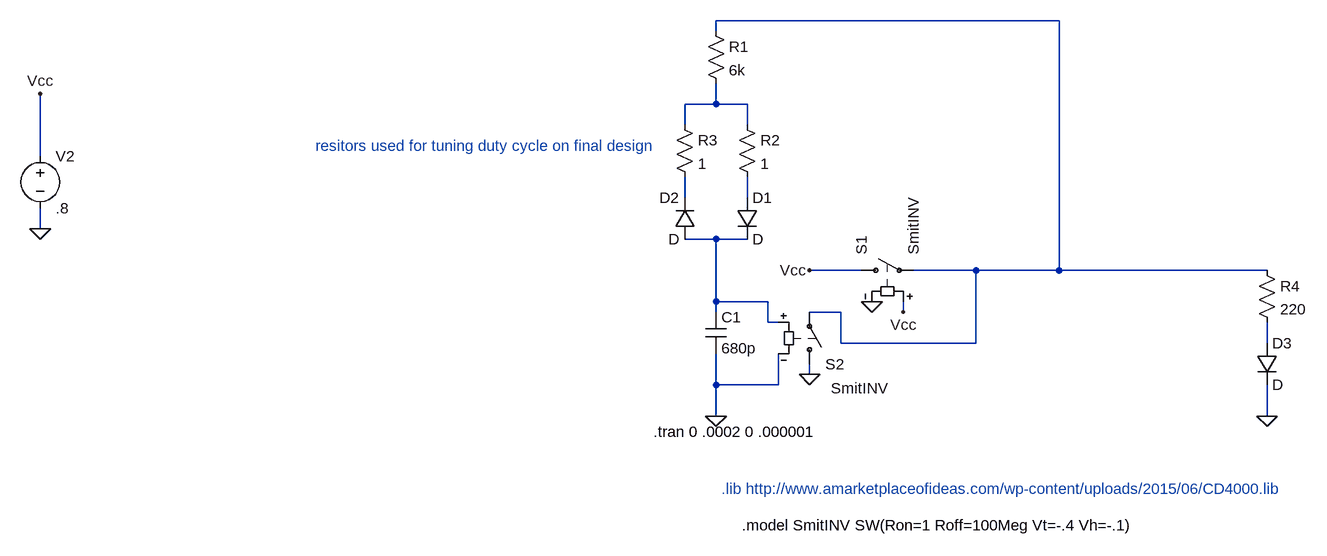
[diagram p0: schematic BRD2.asc]
BRD2.asc, the LTspice schematic file:
Version 4
SHEET 1 1188 1056
WIRE 592 48 64 48
WIRE 64 64 64 48
WIRE 64 176 64 144
WIRE 64 176 16 176
WIRE 112 176 64 176
WIRE 16 208 16 176
WIRE 112 208 112 176
WIRE -976 256 -976 160
WIRE 16 320 16 288
WIRE 112 320 112 288
WIRE -976 368 -976 336
WIRE 64 384 16 384
WIRE 112 384 64 384
WIRE 288 432 208 432
WIRE 464 432 368 432
WIRE 592 432 592 48
WIRE 592 432 464 432
WIRE 912 432 592 432
WIRE 64 480 64 384
WIRE 144 480 64 480
WIRE 64 496 64 480
WIRE 256 496 208 496
WIRE 352 496 352 480
WIRE 144 512 144 480
WIRE 160 512 144 512
WIRE 256 544 256 496
WIRE 464 544 464 432
WIRE 464 544 256 544
WIRE 912 544 912 512
WIRE 208 592 208 576
WIRE 64 608 64 560
WIRE 160 608 160 560
WIRE 160 608 64 608
WIRE 64 656 64 608
WIRE 912 656 912 608
FLAG 64 656 0
FLAG 912 656 0
FLAG -976 368 0
FLAG -976 160 Vcc
FLAG 208 432 Vcc
FLAG 304 480 0
FLAG 208 592 0
FLAG 352 496 Vcc
SYMBOL res 48 48 R0
SYMATTR InstName R1
SYMATTR Value 6k
SYMBOL res 96 192 R0
SYMATTR InstName R2
SYMATTR Value 1
SYMBOL res 0 192 R0
SYMATTR InstName R3
SYMATTR Value 1
SYMBOL diode 96 320 R0
SYMATTR InstName D1
SYMBOL diode 32 384 R180
WINDOW 0 24 64 Left 2
WINDOW 3 24 0 Left 2
SYMATTR InstName D2
SYMBOL cap 48 496 R0
SYMATTR InstName C1
SYMATTR Value 680p
SYMATTR SpiceLine V=6.3 Irms=17.6m Rser=6.49235 Lser=0 mfg="KEMET" pn="C0603C681K9RAC" type="X7R"
SYMBOL res 896 416 R0
SYMATTR InstName R4
SYMATTR Value 220
SYMBOL diode 896 544 R0
SYMATTR InstName D3
SYMBOL voltage -976 240 R0
WINDOW 123 0 0 Left 2
WINDOW 39 0 0 Left 2
SYMATTR InstName V2
SYMATTR Value .8
SYMBOL sw 272 432 R270
SYMATTR InstName S1
SYMATTR Value SmitINV
SYMBOL sw 208 592 M180
WINDOW 3 33 -21 Left 2
SYMATTR InstName S2
SYMATTR Value SmitINV
TEXT -32 680 Left 2 !.tran 0 .0002 0 .000001
TEXT 72 768 Left 2 ;.lib http://www.amarketplaceofideas.com/wp-content/uploads/2015/06/CD4000.lib
TEXT -552 240 Left 2 ;resitors used for tuning duty cycle on final design
TEXT 104 824 Left 2 !.model SmitINV SW(Ron=1 Roff=100Meg Vt=-.4 Vh=-.1)

The netlist it stands for:
* BRD2.asc
R1 N001 N002 6k
R2 N002 N004 1
R3 N002 N003 1
D1 N004 N005 D
D2 N005 N003 D
C1 N005 0 680p V=6.3 Irms=17.6m Rser=6.49235 Lser=0 mfg="KEMET" pn="C0603C681K9RAC" type="X7R"
R4 N001 N006 220
D3 N006 0 D
V2 Vcc 0 .8
S1 Vcc N001 Vcc 0 SmitINV
S2 0 N001 N005 0 SmitINV
.model D D
.lib standard.dio
.tran 0 .0002 0 .000001
* .lib http://www.amarketplaceofideas.com/wp-content/uploads/2015/06/CD4000.lib
* resitors used for tuning duty cycle on final design
.model SmitINV SW(Ron=1 Roff=100Meg Vt=-.4 Vh=-.1)
.backanno
.end